# Altium project SAVELIEV_OLEKSANDR_KV_22_COURSEWORK.PrjPcb
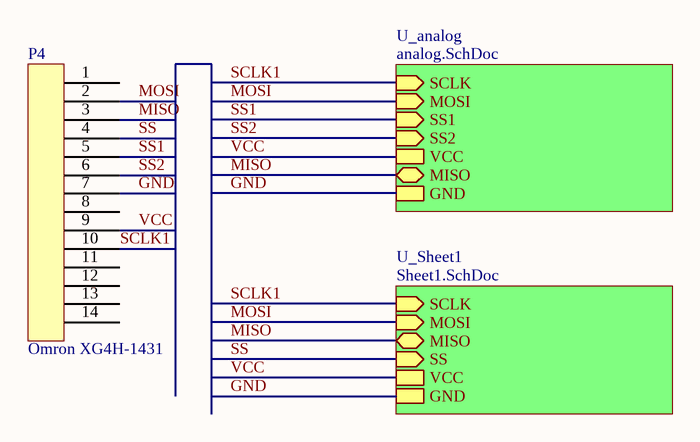
[diagram p0: KR1.SchDoc]
4 sheets, 168 parts. Net scope: hierarchical (ports join the sheet entries above them; power ports are global).
Sheets:
  KR1.SchDoc
    U_analog = analog.SchDoc
    U_Sheet1 = Sheet1.SchDoc
      U_Sheet2 = Sheet2.SchDoc
      U_Sheet2 = Sheet2.SchDoc
      U_Sheet2 = Sheet2.SchDoc
      U_Sheet2 = Sheet2.SchDoc

## Sheet KR1.SchDoc
size A4; SheetNumber: 1; SheetTotal: 4

### Parts
P4  Omron XG4H-1431  [PCB-ufmg19m1jja1hi8pwkok-1]

### Sub-sheets
U_analog = analog.SchDoc: SCLK (in), MOSI (in), SS1 (in), SS2 (in), VCC, MISO (bidir), GND
U_Sheet1 = Sheet1.SchDoc: SCLK (in), MOSI (in), MISO (bidir), SS (in), VCC, GND

### Nets
GND: P4.7 ; sheet U_analog/GND, sheet U_Sheet1/GND
MISO: P4.3 ; sheet U_analog/MISO, sheet U_Sheet1/MISO
MOSI: P4.2 ; sheet U_analog/MOSI, sheet U_Sheet1/MOSI
SCLK1: P4.10 ; sheet U_analog/SCLK, sheet U_Sheet1/SCLK
SS: P4.4 ; sheet U_Sheet1/SS
SS1: P4.5 ; sheet U_analog/SS1
SS2: P4.6 ; sheet U_analog/SS2
VCC: P4.9 ; sheet U_analog/VCC, sheet U_Sheet1/VCC

Not connected (* = marked no-connect by the designer): P4 1 8 11 12 13 14

### Library data of the parts
P4 = CMP-754fbc3c8639aa88-2: Conn Socket Strip SKT 14 POS 2.54mm Solder ST Thru-Hole; Manufacturer Part Number: XG4H-1431; Mounting Style: Through Hole; OctopartID: 754fbc3c8639aa88; RoHS: Compliant; Octopart URL: https://octopart.com/xg4h-1431-omron-7984656; Packaging: Bulk; Color: Black

## Sheet analog.SchDoc
size A3; SheetNumber: 4; SheetTotal: 4
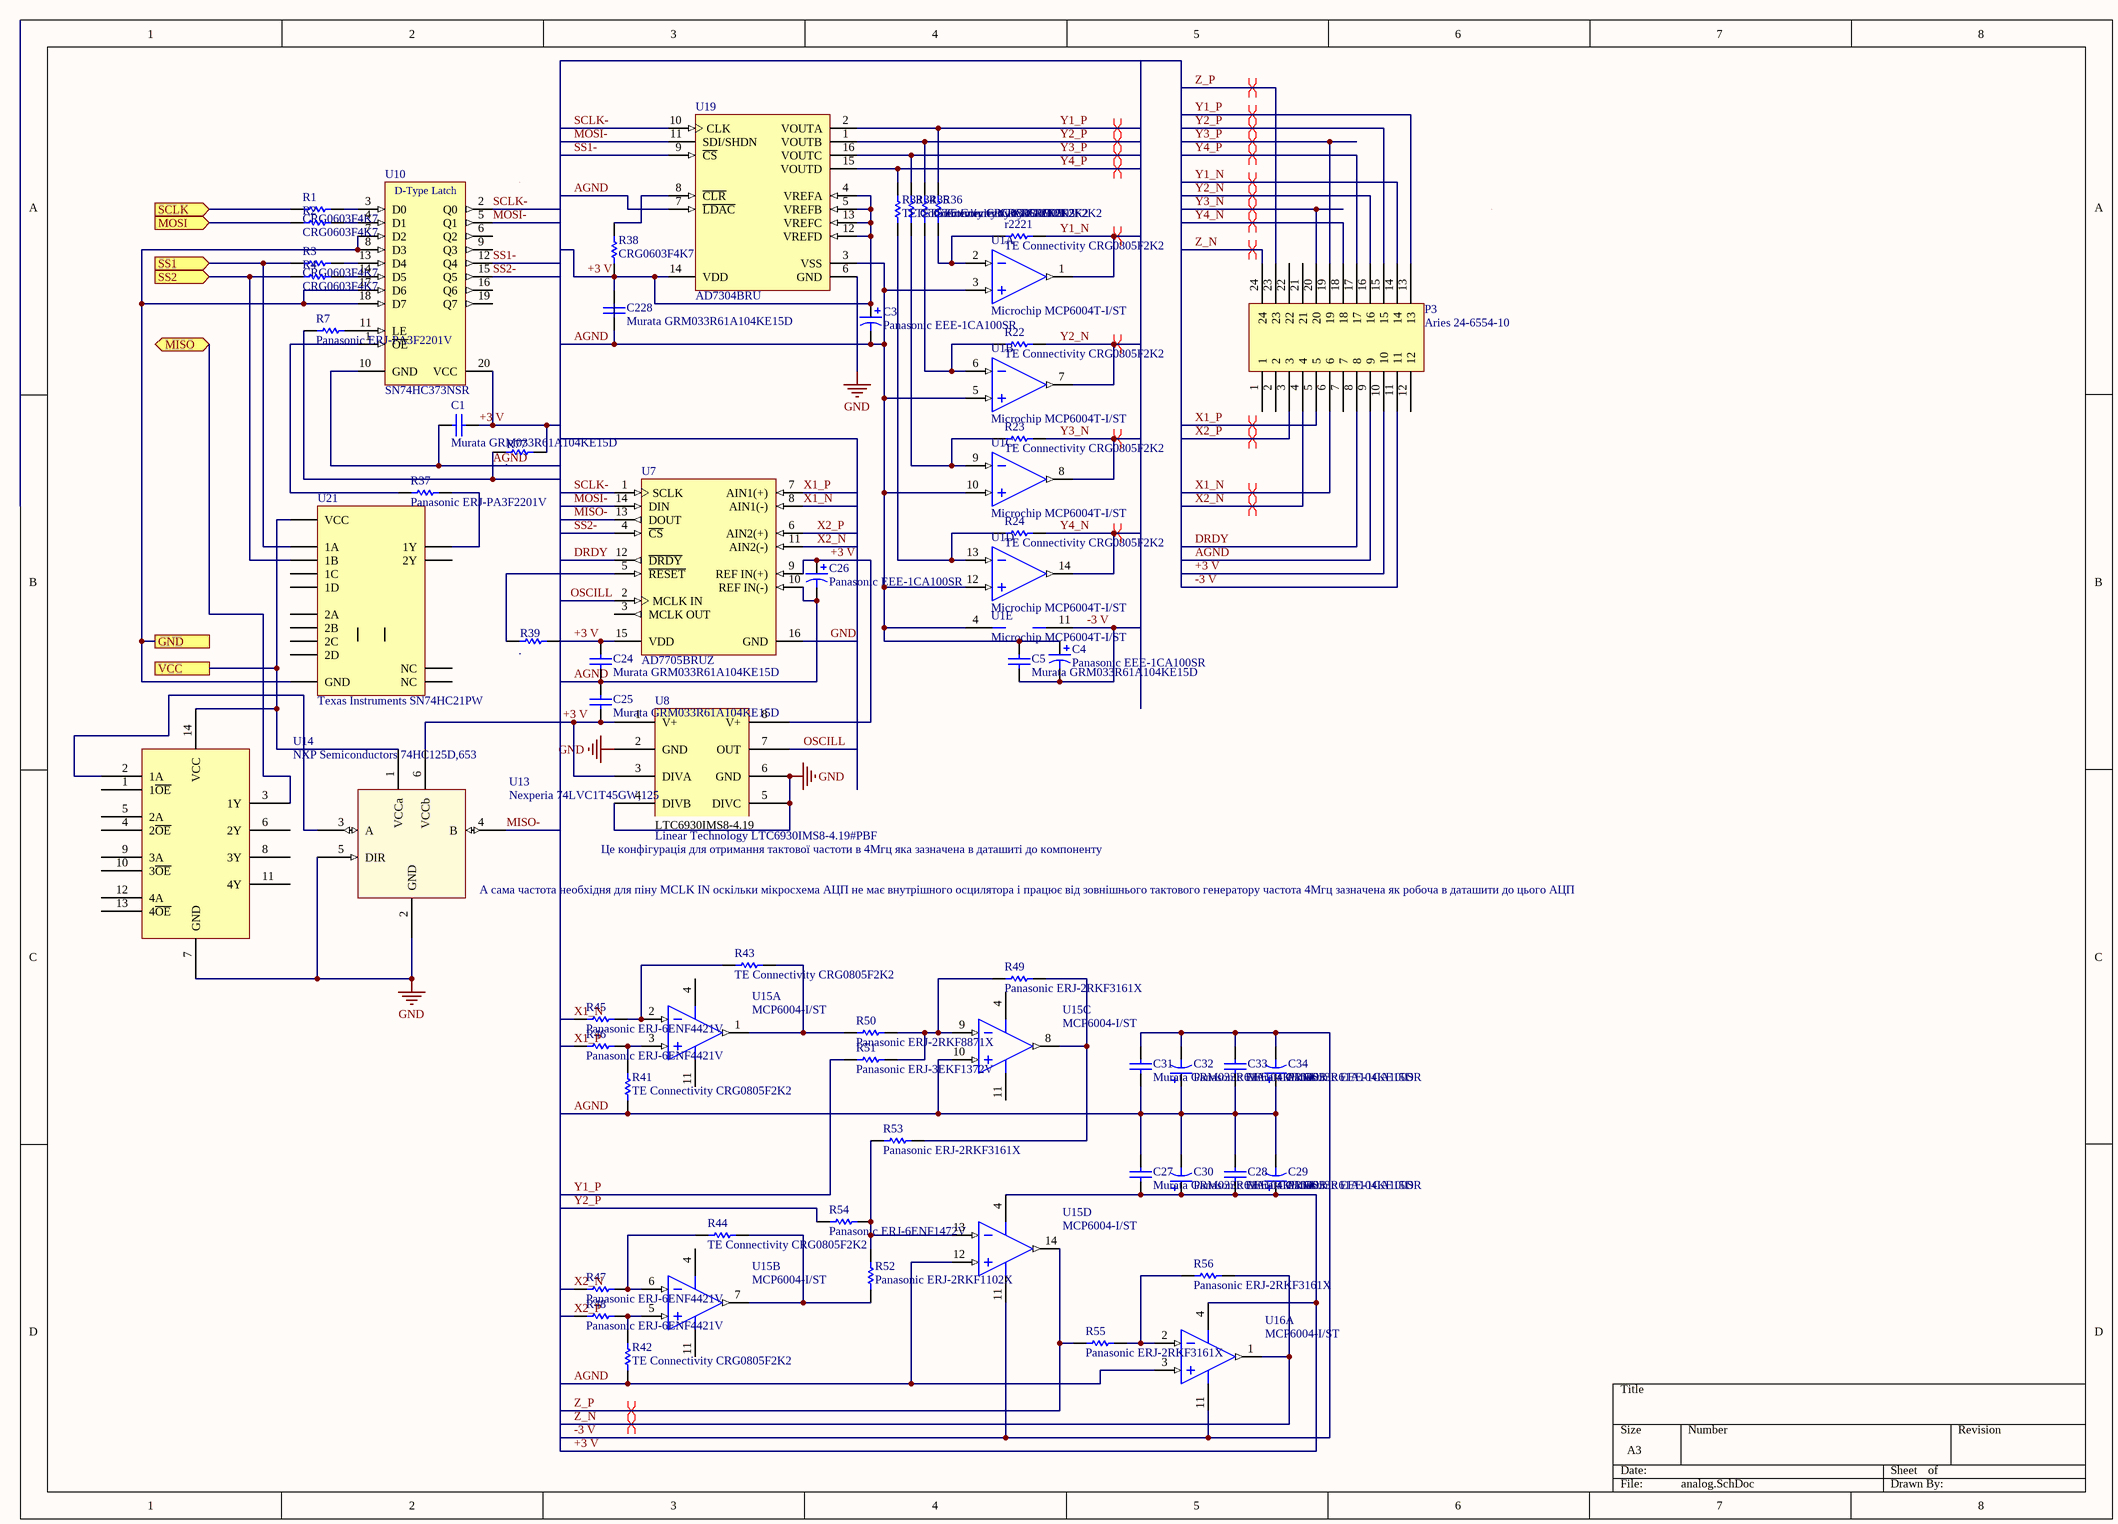
[diagram p1: analog.SchDoc]

### Parts
C1  Murata GRM033R61A104KE15D  [201-cap]
C3  Panasonic EEE-1CA100SR  [PCB-5c7lwdch6d5n3jfyiyq6-1]
C4  Panasonic EEE-1CA100SR  [PCB-5c7lwdch6d5n3jfyiyq6-1]
C5  Murata GRM033R61A104KE15D  [201-cap]
C24  Murata GRM033R61A104KE15D  [201-cap]
C25  Murata GRM033R61A104KE15D  [201-cap]
C26  Panasonic EEE-1CA100SR  [PCB-5c7lwdch6d5n3jfyiyq6-1]
C27  Murata GRM033R61A104KE15D  [201-cap]
C28  Murata GRM033R61A104KE15D  [201-cap]
C29  Panasonic EEE-1CA100SR  [PCB-5c7lwdch6d5n3jfyiyq6-1]
C30  Panasonic EEE-1CA100SR  [PCB-5c7lwdch6d5n3jfyiyq6-1]
C31  Murata GRM033R61A104KE15D  [201-cap]
C32  Panasonic EEE-1CA100SR  [PCB-5c7lwdch6d5n3jfyiyq6-1]
C33  Murata GRM033R61A104KE15D  [201-cap]
C34  Panasonic EEE-1CA100SR  [PCB-5c7lwdch6d5n3jfyiyq6-1]
C228  Murata GRM033R61A104KE15D  [201-cap]
P3  Aries 24-6554-10  [PCB-ekyruasckp3dwikngkzw-1]
R1  CRG0603F4K7  [RESC1609X50X30ML10T20]
R2  CRG0603F4K7  [RESC1609X50X30ML10T20]
R3  CRG0603F4K7  [RESC1609X50X30ML10T20]
R4  CRG0603F4K7  [RESC1609X50X30ML10T20]
R7  Panasonic ERJ-PA3F2201V  [RESC1608X55X30LL15T15]
R22  TE Connectivity CRG0805F2K2  [RESC3216X70X50LL05T20]
R23  TE Connectivity CRG0805F2K2  [RESC3216X70X50LL05T20]
R24  TE Connectivity CRG0805F2K2  [RESC3216X70X50LL05T20]
R33  TE Connectivity CRG0805F2K2  [RESC3216X70X50LL05T20]
R34  TE Connectivity CRG0805F2K2  [RESC3216X70X50LL05T20]
R35  TE Connectivity CRG0805F2K2  [RESC3216X70X50LL05T20]
R36  TE Connectivity CRG0805F2K2  [RESC3216X70X50LL05T20]
R37  Panasonic ERJ-PA3F2201V  [RESC1608X55X30LL15T15]
R38  CRG0603F4K7  [RESC1609X50X30ML10T20]
R39  .  [RESC1608X55X30LL15T15]
R41  TE Connectivity CRG0805F2K2  [RESC3216X70X50LL05T20]
R42  TE Connectivity CRG0805F2K2  [RESC3216X70X50LL05T20]
R43  TE Connectivity CRG0805F2K2  [RESC3216X70X50LL05T20]
R44  TE Connectivity CRG0805F2K2  [RESC3216X70X50LL05T20]
R45  Panasonic ERJ-6ENF4421V  [RESC2013X70X40ML20T20]
R46  Panasonic ERJ-6ENF4421V  [RESC2013X70X40ML20T20]
R47  Panasonic ERJ-6ENF4421V  [RESC2013X70X40ML20T20]
R48  Panasonic ERJ-6ENF4421V  [RESC2013X70X40ML20T20]
R49  Panasonic ERJ-2RKF3161X  [RESC1005X40X25ML05T05]
R50  Panasonic ERJ-2RKF8871X  [RESC1005X40X25ML05T05]
R51  Panasonic ERJ-3EKF1372V  [RESC1608X55X30LL15T15]
R52  Panasonic ERJ-2RKF1102X  [RESC1005X40X25ML05T05]
R53  Panasonic ERJ-2RKF3161X  [RESC1005X40X25ML05T05]
R54  Panasonic ERJ-6ENF1472V  [RESC2013X70X40LL20T20]
R55  Panasonic ERJ-2RKF3161X  [RESC1005X40X25ML05T05]
R56  Panasonic ERJ-2RKF3161X  [RESC1005X40X25ML05T05]
R77  .  [RESC1608X55X30LL15T15]
r2221  TE Connectivity CRG0805F2K2  [RESC3216X70X50LL05T20]
U1  Microchip MCP6004T-I/ST  [PCB-qd5l9gv8ivpyuc7qt6ns-1]  (parts A,B,C,D,E of 5)
U7  AD7705BRUZ  [RU-16_N]
U8  Linear Technology LTC6930IMS8-4.19#PBF  [PCB-f6jmd1xdx0tvjqeq7wyy-1]
U10  SN74HC373NSR  [PCB-mrivl7f71t22rnyfb9oh-1]
U13  Nexperia 74LVC1T45GW,125  [PCB-2kx227qvn7pif93bx96a-1]
U14  NXP Semiconductors 74HC125D,653  [SO14]
U15  MCP6004-I/ST  [TSSOP-ST14_L]  (parts A,B,C,D of 4)
U16  MCP6004-I/ST  [TSSOP-ST14_L]  (part A of 4)
U19  AD7304BRU  [RU-16_M]
U21  Texas Instruments SN74HC21PW  [PCB-zlibg0os7u66y1b7c6dv-1]

### Ports
GND, MISO (bidir), MOSI (in), SCLK (in), SS1 (in), SS2 (in), VCC

### Nets
GND: U7.16(GND) U8.2(GND) U8.4(DIVB) U8.5(DIVC) U8.6(GND) U10.7(D2) U10.8(D3) U10.17(D6) U10.18(D7) U13.2(GND) U13.5(DIR) U14.7(GND) U19.6(GND) U21.7(GND) ; port GND
+3 V: C1.2 C3.1 C24.1 C25.2 C26.1 C27.2 C28.2 C29.1 C30.1 C228.1 P3.10 R38.1 R39.2 R77.2 U7.9(REF_IN(+)) U7.15(VDD) U8.1(V+) U8.3(DIVA) U8.8(V+) U10.20(VCC) U13.6(VCCb) U15.4(VDD) U16.4(VDD) U19.4(VREFA) U19.5(VREFB) U19.12(VREFD) U19.13(VREFC) U19.14(VDD)
-3 V: C4.2 C5.2 C31.1 C32.2 C33.1 C34.2 P3.11 U1.11(VSS) U15.11(VSS) U16.11(VSS)
AGND: C1.1 C3.2 C4.1 C5.1 C24.2 C25.1 C26.2 C27.1 C28.1 C29.2 C30.2 C31.2 C32.1 C33.2 C34.1 C228.2 P3.9 R7.1 R41.1 R42.1 R77.1 U1.3(INA+) U1.4(VDD) U1.5(INB+) U1.10(INC+) U1.12(IND+) U7.10(REF_IN(-)) U10.10(GND) U15.10(VINC+) U15.12(VIND+) U16.3(VINA+) U19.3(VSS) U19.7(~{LDAC})
DRDY: P3.8 U7.12(~{DRDY})
MISO: U14.3(1Y) ; port MISO
MISO-: U7.13(DOUT) U13.4(B)
MOSI: R2.1 ; port MOSI
MOSI-: U7.14(DIN) U10.5(Q1) U19.11(SDI/SHDN)
OSCILL: U7.2(MCLK_IN) U8.7(OUT)
SCLK1: R1.1 ; port SCLK
SCLK-: U7.1(SCLK) U10.2(Q0) U19.10(CLK)
SS1: R3.1 U21.1(1A) ; port SS1
SS1-: U10.12(Q4) U19.9(~{CS})
SS2: R4.1 U21.2(1B) ; port SS2
SS2-: U7.4(~{CS}) U10.15(Q5)
VCC: U13.1(VCCa) U14.14(VCC) U21.14(VCC) ; port VCC
X1_N: P3.6 R45.1 U7.8(AIN1(-))
X1_P: P3.5 R46.1 U7.7(AIN1(+))
X2_N: P3.4 R47.1 U7.11(AIN2(-))
X2_P: P3.3 R48.1 U7.6(AIN2(+))
Y1_N: P3.14 r2221.2 U1.1(OUTA)
Y1_P: P3.13 R36.2 R51.1 U19.2(VOUTA)
Y2_N: P3.16 R22.2 U1.7(OUTB)
Y2_P: P3.15 R35.2 R54.1 U19.1(VOUTB)
Y3_N: P3.20 R23.2 U1.8(OUTC)
Y3_P: P3.19 R34.2 U19.16(VOUTC)
Y4_N: P3.18 R24.2 U1.14(OUTD)
Y4_P: P3.17 R33.2 U19.15(VOUTD)
Z_N: P3.24 R56.2 U16.1(VOUTA)
Z_P: P3.23 R55.1 U15.14(VOUTD)
NetR1_2: R1.2 U10.3(D0)
NetR2_2: R2.2 U10.4(D1)
NetR3_2: R3.2 U10.13(D4)
NetR4_2: R4.2 U10.14(D5)
NetR7_2: R7.2 U10.11(LE)
NetR22_1: R22.1 R35.1 U1.6(INB-)
NetR23_1: R23.1 R34.1 U1.9(INC-)
NetR24_1: R24.1 R33.1 U1.13(IND-)
NetR36_1: R36.1 r2221.1 U1.2(INA-)
NetR37_1: R37.1 U10.1(~{OE})
NetR37_2: R37.2 U21.6(1Y)
NetR38_2: R38.2 U19.8(~{CLR})
NetR39_1: R39.1 U7.5(~{RESET})
NetR41_2: R41.2 R46.2 U15.3(VINA+)
NetR42_2: R42.2 R48.2 U15.5(VINB+)
NetR43_1: R43.1 R50.1 U15.1(VOUTA)
NetR43_2: R43.2 R45.2 U15.2(VINA-)
NetR44_1: R44.1 R52.1 U15.7(VOUTB)
NetR44_2: R44.2 R47.2 U15.6(VINB-)
NetR49_1: R49.1 R50.2 R51.2 U15.9(VINC-)
NetR49_2: R49.2 R53.2 U15.8(VOUTC)
NetR52_2: R52.2 R53.1 R54.2 U15.13(VIND-)
NetR55_2: R55.2 R56.1 U16.2(VINA-)
NetU13_3: U13.3(A) U14.2(1A)

Not connected (* = marked no-connect by the designer): P3 1 2 7 12 21 22; U7 3(MCLK_OUT); U10 6(Q2) 9(Q3) 16(Q6) 19(Q7); U14 1(1~{OE}) 4(2~{OE}) 5(2A) 6(2Y) 8(3Y) 9(3A) 10(3~{OE}) 11(4Y) 12(4A) 13(4~{OE}); U21 3(NC) 4(1C) 5(1D) 8(2Y) 9(2A) 10(2B) 11(NC) 12(2C) 13(2D)

### Layout directives
differential pair: X1_N, X1_P, X2_N, X2_P, Y1_N, Y1_P, Y2_N, Y2_P, Y3_N, Y3_P, Y4_N, Y4_P, Z_N, Z_P

### Notes on the sheet
- (near U8) Це конфігурація для отримання тактової частоти в 4Мгц яка зазначена в даташиті до компоненту
- (near U13) А сама частота необхідня для піну MCLK IN оскільки мікросхема АЦП не має внутрішного осцилятора і працює від зовнішнього тактового генератору частота 4Мгц зазначена як робоча в даташити до цього АЦП
- (in symbol CMP-209beb569da8ff5c-2) D-Type Latch
- (in symbol CMP-b5277c902da26ae0-2) LTC6930IMS8-4.19

### Library data of the parts
C1 C5 C24 C25 C27 C28 C31 C33 C228 = CMP-118834-6: Cap Ceramic 0.1uF 10V X5R 10% SMD 0201 85C Paper T/R; Lead-Free Status: Lead Free; Case/Package (SI): 0603; Capacitance: 100 nF; REACH SVHC Compliance: No SVHC; Capacitance Tolerance: ±10%; Voltage Rating (DC): 10 V; Lifecycle Status: Active; Octopart Url: https://octopart.com/grm033r61a104ke15d-murata-9105476; Footprint: PCB-ocfpa7uzfom1ouwa1npm-1; Size-Length: 0.0006 m; Size-Thickness: 0.0003 m; Manufacturer Part Number: GRM033R61A104KE15D; Dielectric Characteristic: X5R; OctopartID: 128bdb0bc7a9cd4c; RoHS: Compliant; Size-Width: 0.0003 m
C3 C4 C26 C29 C30 C32 C34 = CMP-1d6cd72bfd77c2ab-7: Capacitor Alum Elec, 10uf, 16v, 20%, Scapacitor Alum Elec, 10uf, 16v, 20%, Smd, Full Reel; Footprint: PCB-yczte4gnpn9q1jdovplr-1
P3 = CMP-1a82d3838c70c545-1: Connector Test Socket Receptacle 24 Position 2.54mm Solder Straight Thru-Hole; Number of Positions: 24; Lead-Free Status: Lead Free; Insulation Resistance: 1.00 GΩ; Number of Mating Cycles: 25000; Mounting Angle: 180 °; Contact Material: Beryllium Copper; Flammability Rating: UL 94 V-0; Size-Width: 22.9 mm; Number of Contacts: 24; Number of Pins: 24; Packaging: Tube; Octopart URL: https://octopart.com/24-6554-10-aries-766868; Contact Plating: Tin, Tin over Nickel; RoHS: Compliant; Size-Height: 11.9 mm; Size-Length: 44.2 mm; Manufacturer Part Number: 24-6554-10; Mounting Style: PC Board, Through Hole, Vertical; OctopartID: 1a82d3838c70c545; Operating Temperature: 105 °C (max); REACH SVHC Compliance: No SVHC
R1-R4 R38 = CMP-0018c9d2ab3ddfdf-10: Res Thick Film 0603 4.7K Ohm 1% 0.1W(1/10W) ±100ppm/C Pad SMD T/R; ELV Compliant: Compliant; Power Rating: 100 mW; Resistance: 4.70 kΩ; Octopart Url: https://octopart.com/crg0603f4k7-te+connectivity-12619331; RoHS: Compliant; Mounting Style: Surface Mount; OctopartID: 0018c9d2ab3ddfdf; Manufacturer Part Number: CRG0603F4K7; Lifecycle Status: Active; Packaging: Tape & Reel (TR)
R7 R37 = CMP-b7b87dbc5d06687f-2: Res Thick Film 0603 2.2K Ohm 1% 0.25W(1/4W) ±100ppm/C Pad SMD Automotive T/R; Temperature Coefficient: -100 ppm/°C to 100 ppm/°C; Resistance: 2.20 kΩ; Case/Package (SI): 1608; Power Rating: 250 mW; Voltage Rating (DC): 150 V; RoHS: Compliant; Packaging: Cut Tape (CT); Lifecycle Status: Not Listed by Manufacturer; Manufacturer Part Number: ERJ-PA3F2201V; Resistance Tolerance: ±1%; Footprint: PCB-0002-00066-3; OctopartID: b7b87dbc5d06687f; Octopart URL: https://octopart.com/erj-pa3f2201v-panasonic-51302360; REACH SVHC Compliance: No SVHC; Case/Package: 1608, 0603
R22-R24 R33-R36 R41-R44 r2221 = CMP-5b0a92f52cd384cd-1: Res Thick Film 0805 2.2K Ohm 1% 0.125W(1/8W) ±100ppm/C Pad SMD T/R; Resistance: 2.20 kΩ; ELV Compliant: Compliant; Power Rating: 125 mW; Case/Package (SI): 2012; OctopartID: 5b0a92f52cd384cd; Case/Package: 0805; Mounting Style: Surface Mount; Manufacturer Part Number: CRG0805F2K2; Octopart Url: https://octopart.com/crg0805f2k2-te+connectivity-16077503; RoHS: Compliant; Lifecycle Status: Active; Packaging: Tape & Reel (TR)
R39 R77 = CMP-b7b87dbc5d06687f-2: Res Thick Film 0603 2.2K Ohm 1% 0.25W(1/4W) ±100ppm/C Pad SMD Automotive T/R; Manufacturer Part Number: ERJ-PA3F2201V; Temperature Coefficient: -100 ppm/°C to 100 ppm/°C; Resistance: 2.20 kΩ; Case/Package (SI): 1608; Power Rating: 250 mW; Voltage Rating (DC): 150 V; RoHS: Compliant; Packaging: Cut Tape (CT); Lifecycle Status: Not Listed by Manufacturer; Resistance Tolerance: ±1%; Footprint: PCB-0002-00066-3; OctopartID: b7b87dbc5d06687f; Octopart URL: https://octopart.com/erj-pa3f2201v-panasonic-51302360; REACH SVHC Compliance: No SVHC; Case/Package: 1608, 0603
R45-R48 = CMP-3915389-2: RESISTOR, THICK FILM, 4.42KOHM, 125mW, ± 1%; Case/Package (SI): 2012; Lead-Free Status: Lead Free; Power Rating: 0.125 W; Resistance: 4420.0 Ω; Voltage Rating (DC): 150.0 V; Manufacturer Part Number: ERJ-6ENF4421V; Case/Package: 0805; Lifecycle Status: Not Listed by Manufacturer; Mounting Style: Surface Mount; Octopart Url: https://octopart.com/erj-6enf4421v-panasonic-55405047; OctopartID: a5ed6faae97c7a2a; REACH SVHC Compliance: No SVHC; Resistance Tolerance: ±1%; RoHS: Compliant; Size-Height: 0.0006 m; Size-Length: 0.002 m; Size-Width: 0.00125 m
R49 R53 R55 R56 = CMP-3651018-2: Thick Film Resistors - SMD 0402 3.16Kohms 1% Tol; Lead-Free Status: Lead Free; Power Rating: 0.1 W; Resistance: 3160.0 Ω; Voltage Rating (DC): 50.0 V; Case/Package: 0402; Lifecycle Status: Not Listed by Manufacturer; Mounting Style: Surface Mount; Octopart Url: https://octopart.com/erj-2rkf3161x-panasonic-55421100; OctopartID: ad456702208f7282; REACH SVHC Compliance: No SVHC; Resistance Tolerance: ±1%; RoHS: Compliant; Size-Height: 0.00035 m; Size-Length: 0.001 m; Size-Width: 0.0005 m; Manufacturer Part Number: ERJ-2RKF3161X
R50 = CMP-3673565-2: Thick Film Resistors - SMD 0402 8.87Kohms 1% Tol; Lead-Free Status: Contains Lead; Power Rating: 0.1 W; Resistance: 8870.0 Ω; Voltage Rating (DC): 50.0 V; Manufacturer Part Number: ERJ-2RKF8871X; Case/Package: 0402; Lifecycle Status: Not Listed by Manufacturer; Mounting Style: Surface Mount; Octopart Url: https://octopart.com/erj-2rkf8871x-panasonic-55421316; OctopartID: d2f818bf5e1a0d3f; REACH SVHC Compliance: No SVHC; Resistance Tolerance: ±1%; RoHS: Compliant; Size-Height: 0.00035 m; Size-Length: 0.001 m; Size-Width: 0.0005 m
R51 = CMP-3656443-2: Thick Film Resistors - SMD 0603 13.7Kohms 1% Tol; Lead-Free Status: Contains Lead; Power Rating: 0.1 W; Resistance: 13700.0 Ω; Voltage Rating (DC): 75.0 V; Manufacturer Part Number: ERJ-3EKF1372V; Case/Package: 0603; Lifecycle Status: Not Listed by Manufacturer; Mounting Style: Surface Mount; Octopart Url: https://octopart.com/erj-3ekf1372v-panasonic-55411167; OctopartID: ddb117f679080276; Packaging: Cut Tape (CT); REACH SVHC Compliance: No SVHC; Resistance Tolerance: ±1%; RoHS: Compliant; Size-Height: 0.00045 m; Size-Length: 0.0016 m; Size-Width: 0.0008 m
R52 = CMP-1847061-3: Res Thick Film 0402 11K Ohm 1% 1/10W ±100ppm/C Molded SMD Punched Carrier T/R; Voltage Rating (DC): 50.0 V; Lead-Free Status: Lead Free; Resistance: 11000.0 Ω; Power Rating: 0.1 W; Size-Length: 0.001 m; RoHS: Compliant; Resistance Tolerance: ±1%; Octopart Url: https://octopart.com/erj-2rkf1102x-panasonic-55389235; Manufacturer Part Number: ERJ-2RKF1102X; OctopartID: bb9871dfb2cd645f; REACH SVHC Compliance: No SVHC; Size-Width: 0.0005 m; Lifecycle Status: Not Listed by Manufacturer; Size-Height: 0.00035 m; Case/Package: 0402; Footprint: PCB-406olm0ev1nhc4a39vl6-1; Packaging: Cut Tape (CT); Mounting Style: Surface Mount
R54 = CMP-3677441-2: Thick Film Resistors - SMD 0805 14.7Kohms 1% Tol; Case/Package (SI): 2012; Lead-Free Status: Lead Free; Power Rating: 0.125 W; Resistance: 14700.0 Ω; Voltage Rating (DC): 150.0 V; Case/Package: 0805; Lifecycle Status: Not Listed by Manufacturer; Mounting Style: Surface Mount; Octopart Url: https://octopart.com/erj-6enf1472v-panasonic-55422409; OctopartID: 6956a311e1f9b691; REACH SVHC Compliance: No SVHC; Resistance Tolerance: ±1%; RoHS: Compliant; Size-Height: 0.0006 m; Size-Length: 0.002 m; Size-Width: 0.00125 m; Manufacturer Part Number: ERJ-6ENF1472V
U1 = CMP-1324864-8: MCP6004 Series 6 V 1 MHz SMT Low-Power Operational Amplifier - TSSOP-14
U7 = CMP-16014805-4: Dual 16-Bit Sigma-Delta Analog-to-Digital Converter with Serial, SPI Interface, 1 mW, 3 V / 5 V, 500SPS, -40 to +85 degC, RU-16, Pb-Free, Tube; Mil-Spec: No; Number of Bits: 16; Input Impedance: 9000000000.0 Ω; Sample Rate: 500.0 Hz; Lead-Free Status: Contains Lead; Resolution (Bits): 16.0; Supply Current: 0.0013 A; Power Dissipation: 0.0065 W; Input Capacitance: 1e-11 F; Number of Pins: 16; Manufacturer Part Number: AD7705BRUZ; RoHS: Compliant; Packaging: Bulk; Case/Package: TSSOP; OctopartID: 1cf3d5ff1dbec334; Mounting Style: Surface Mount; REACH SVHC Compliance: No SVHC; Octopart Url: https://octopart.com/ad7705bruz-analog+devices-402475; Lifecycle Status: Active
U8 = CMP-b5277c902da26ae0-2: SC-Timing, 32.76kHz-8.192MHz Precision u; SC-Timing, 32.76kHz-8.192MHz Precision uPower Oscillators; Manufacturer Part Number: LTC6930IMS8-5.00#PBF; Frequency: 5.00 MHz; Supply Voltage (DC): 1.70 V (min); Case/Package: MSOP; RoHS: Compliant; Octopart URL: http://octopart.com/ltc6930ims8-5.00%23pbf-linear+technology-12434915; Number of Pins: 8; OctopartID: b5277c902da26ae0
U10 = CMP-209beb569da8ff5c-2: Octal Transparent D-Type Latches With 3-State Outputs 20-SO -40 to 85; Output Current: 7.80 mA; Supply Voltage (DC): 2.00 V to 6.00 V; Output Current Drive: -1.00 mA; Number of Circuits: 8; Voltage Nodes: 6.00 V, 5.00 V, 2.00 V; Lead-Free Status: Lead Free; Polarity: Non-Inverting; Propagation Delay Max (tpd): 32.0 ns; RoHS: Compliant; Octopart URL: http://octopart.com/sn74hc373nsr-texas+instruments-46635093; Number of Pins: 20; REACH SVHC Compliance: No SVHC; Packaging: Tape & Reel (TR); Manufacturer Part Number: SN74HC373NSR; OctopartID: 209beb569da8ff5c; Case/Package: SOP; Number of Outputs: 8; Number of Bits: 8; Mounting Style: Surface Mount; Lifecycle Status: Active
U13 = CMP-9dea5051caa8422d-3: 74LVC1T45; 74LVCH1T45 - Dual supply translating transceiver; 3-state; Supply Voltage (DC): 5.50 V (max), 1.20 V (min); Lead-Free Status: Lead Free; Lifecycle Status: Active; Manufacturer Part Number: 74LVC1T45GW,125; RoHS: Compliant; OctopartID: 9dea5051caa8422d; Number of Pins: 6; Octopart URL: https://octopart.com/74lvc1t45gw%2C125-nexperia-78737956; REACH SVHC Compliance: No SVHC; Operating Temperature: -40.0 °C (min); Case/Package: SOT-363; Mounting Style: Surface Mount; Packaging: Tape & Reel (TR)
U14 = CMP-e63b2fae16a839fc-1: 74HC Series 6 V Surface Mount 3-State Quad Buffer/Line Driver - SOIC-14; Lead-Free Status: Lead Free; Number of Gates: 4; Supply Voltage (DC): 2.00 V (min); REACH SVHC Compliance: No SVHC; Lifecycle Status: Active; Packaging: Tape & Reel (TR); Manufacturer Part Number: 74HC125D,653; OctopartID: e63b2fae16a839fc; Octopart URL: http://octopart.com/74hc125d%2C653-nxp+semiconductors-10474997; Number of Pins: 14; RoHS: Compliant
U15 U16 = CMP-1319670-3: 1 MHz, Low-Power Operational Amplifier, 14-Pin TSSOP, Industrial Temperature; Bandwidth: 1000000.0 Hz; Input Offset Drift: 2e-06 V/K; Lead-Free Status: Lead Free; Number of Circuits: 4; Slew Rate: 0.6 V/μs; Gain Bandwidth Product: 1000000.0 Hz; Lifecycle Status: Active; Mounting Style: Surface Mount; Number of Pins: 14; Octopart Url: https://octopart.com/mcp6004-i%2Fst-microchip-419111; OctopartID: 6e09a7052e48b1ce; REACH SVHC Compliance: No SVHC; RoHS: Compliant; Manufacturer Part Number: MCP6004-I/ST
U19 = CMP-4908888-3: Quad 8-Bit Rail-to-Rail Output Digital-to-Analog Converter, 3 V / 5 V, -40 to +85 degC, RU-16, Tube; Lead-Free Status: Contains Lead; Mil-Spec: No; Number of Bits: 8; Power Dissipation: 0.06 W; Resolution (Bits): 8.0; Manufacturer Part Number: AD7304BRU; Case/Package: TSSOP; Lifecycle Status: Active; Mounting Style: Surface Mount; Number of Pins: 16; Octopart Url: https://octopart.com/ad7304bru-analog+devices-435563; OctopartID: 939e5a9213934c59; Packaging: Bulk; RoHS: Non-Compliant
U21 = CMP-6615af12324ab9d2-2: AND Gate 2-Element 4-IN CMOS 14-Pin TSSOP Tube; Number of Bits: 2; Output Current Drive: -1.00 mA; Supply Voltage (DC): 2.00 V to 6.00 V; Lead-Free Status: Lead Free; Propagation Delay Max (tpd): 140 ns, 24.0 ns; Output Current: 5.20 mA; Voltage Nodes: 2.00 V, 5.00 V, 6.00 V, 4.50 V; Octopart URL: https://octopart.com/sn74hc21pw-texas+instruments-880953; Manufacturer Part Number: SN74HC21PW; OctopartID: 6615af12324ab9d2; REACH SVHC Compliance: No SVHC; Number of Pins: 14; RoHS: Compliant; Case/Package: TSSOP; Packaging: Tube, Rail; Lifecycle Status: Active; Mounting Style: Surface Mount; Number of Gates: 2; Operating Temperature: -40.0 °C to 85.0 °C

## Sheet Sheet1.SchDoc
size A2; SheetNumber: 2; SheetTotal: 4
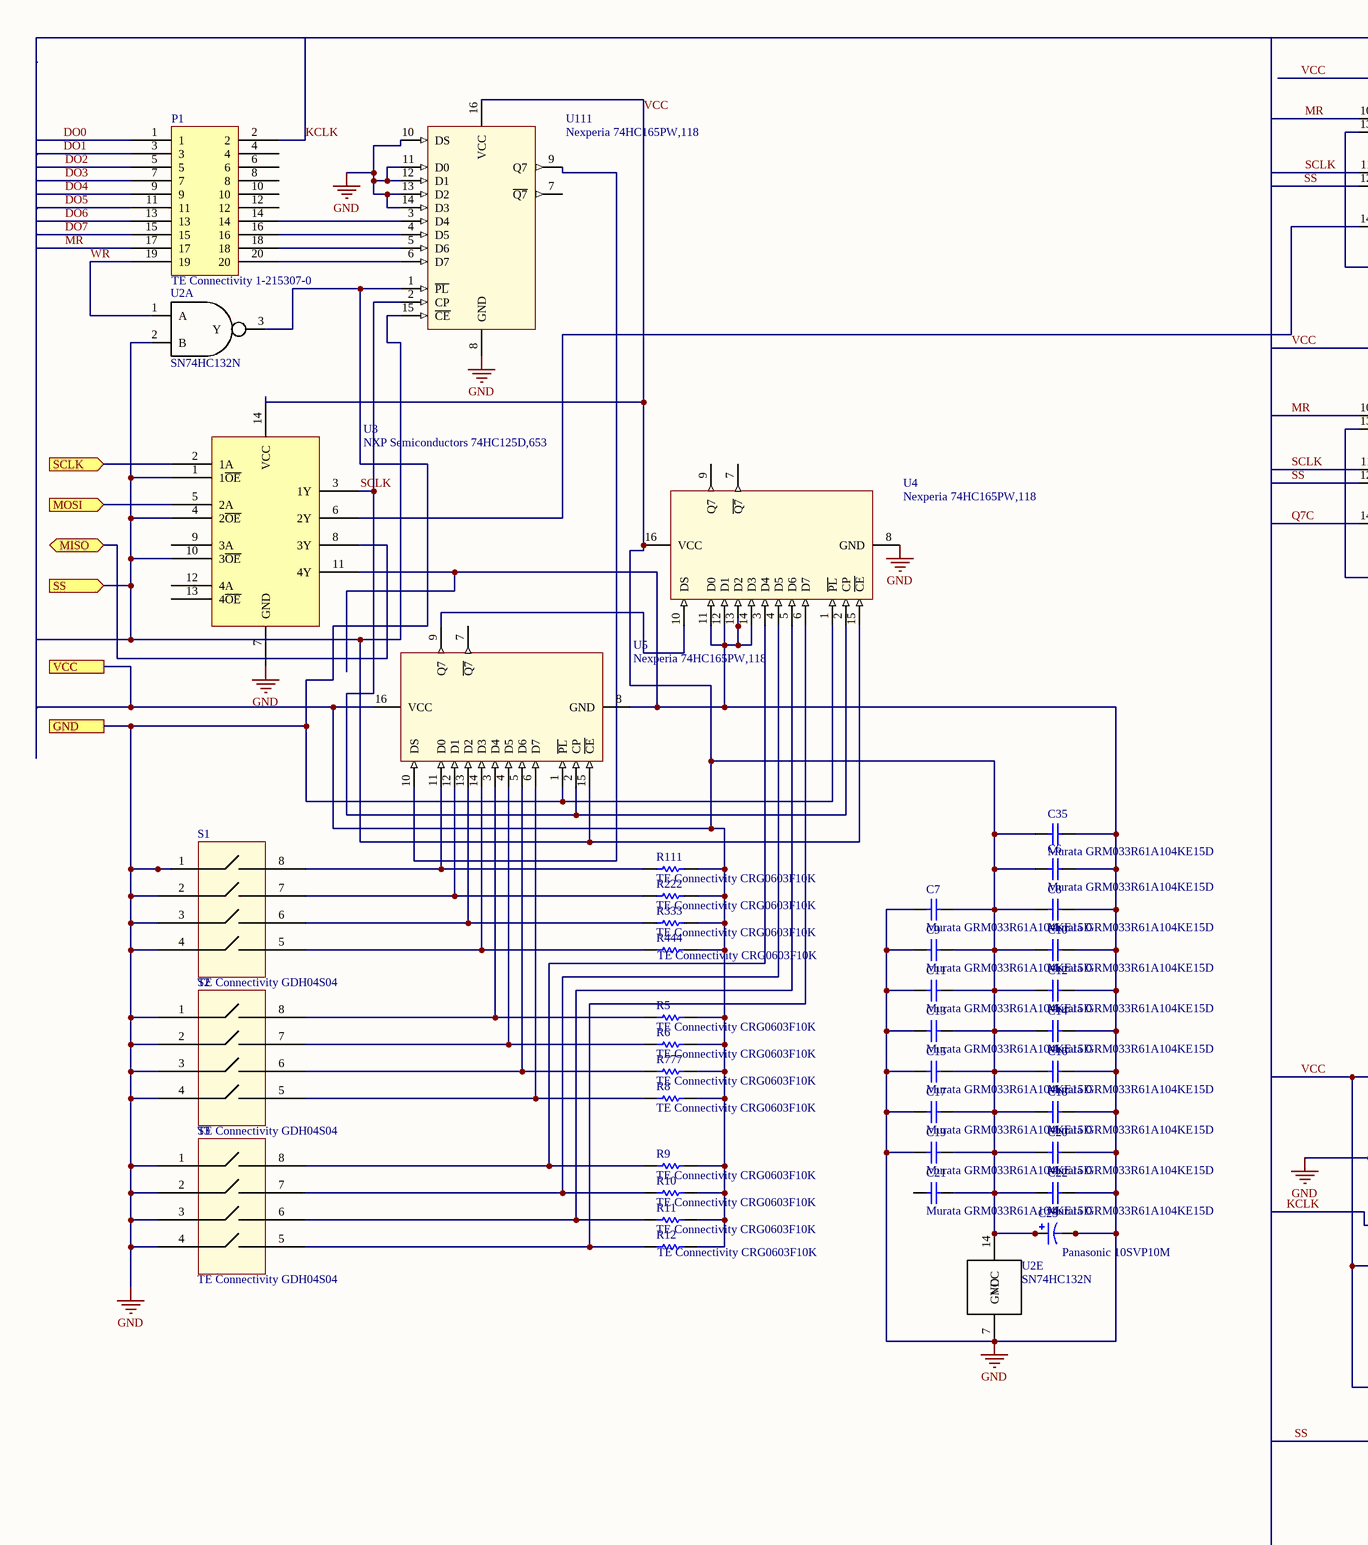
[diagram p2: Sheet1.SchDoc, left]
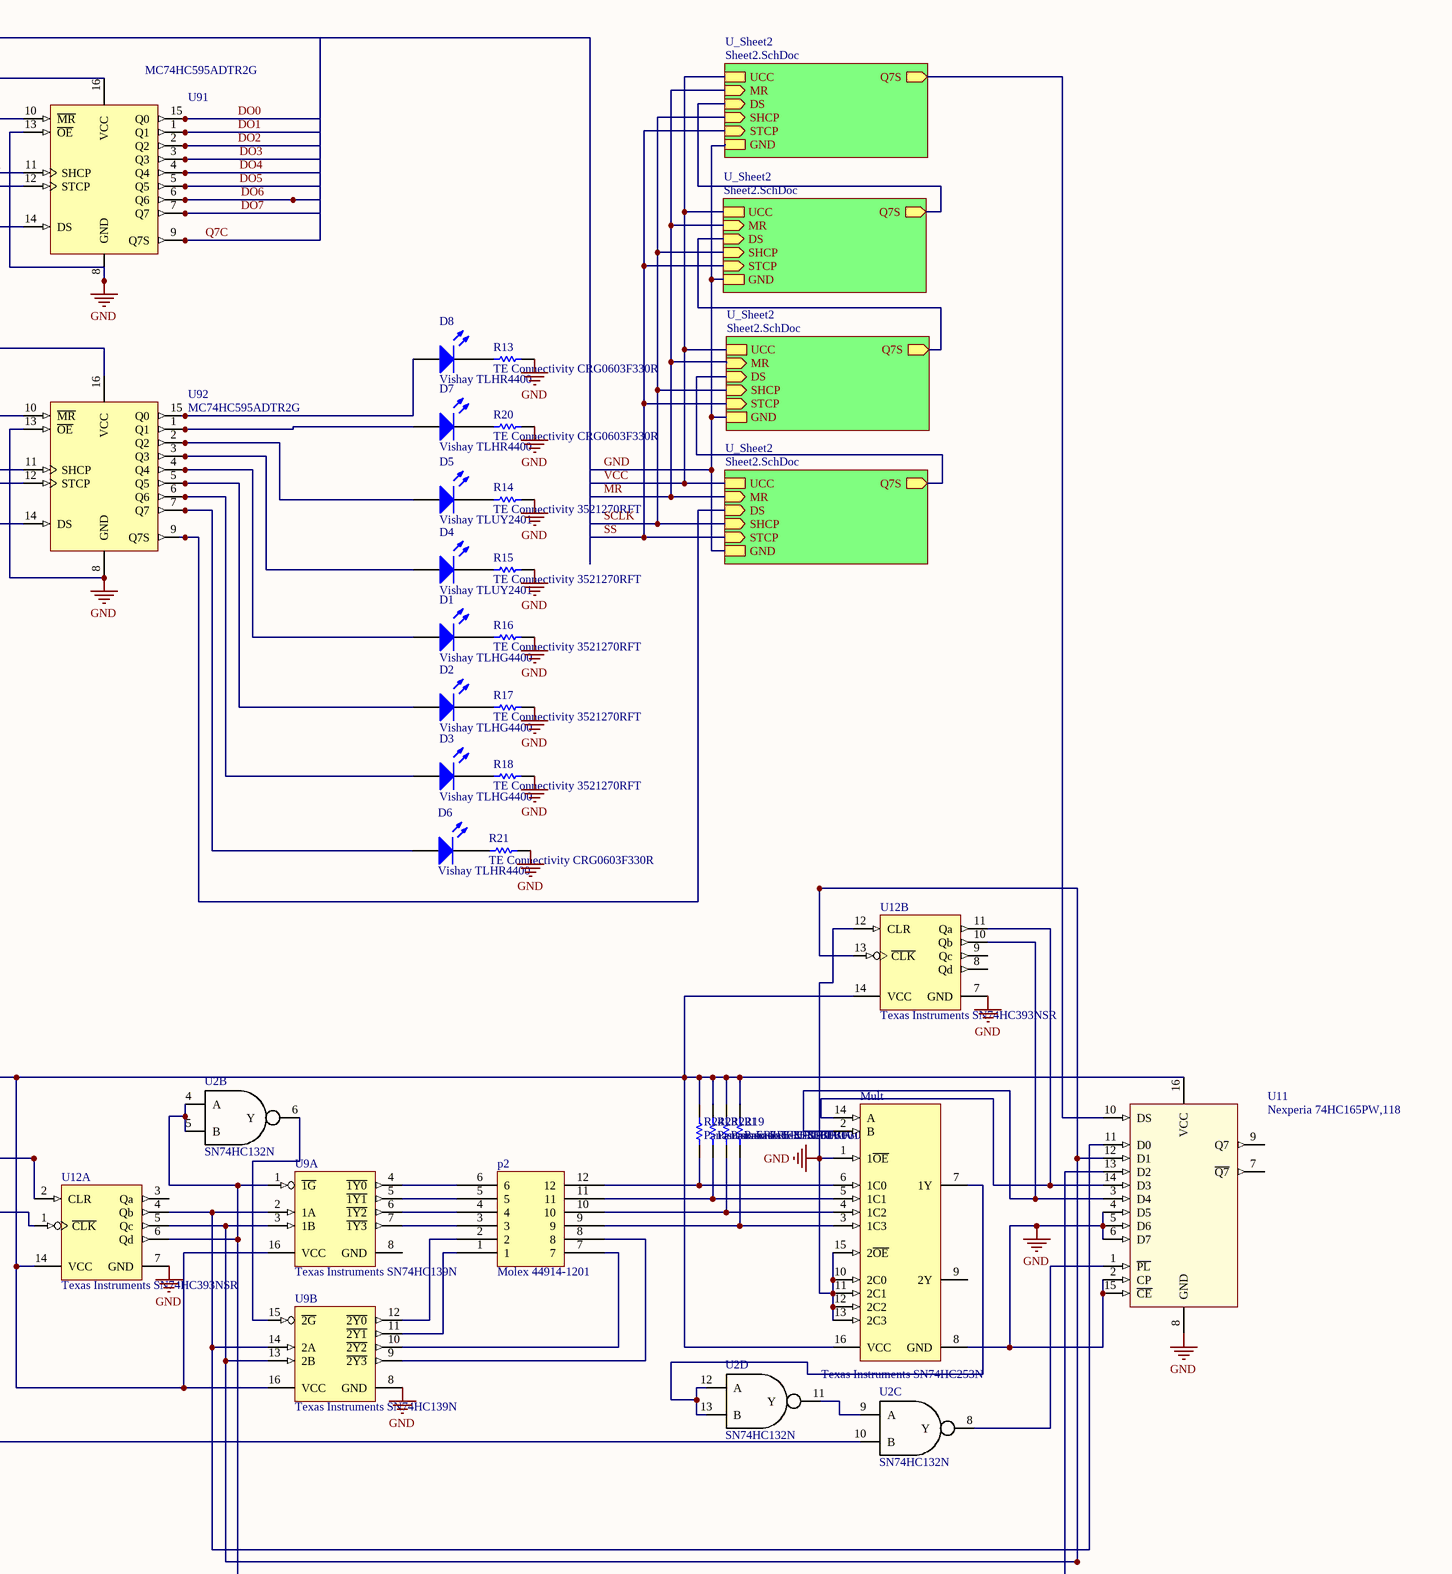
[diagram p3: Sheet1.SchDoc, right]

### Parts
C6  Murata GRM033R61A104KE15D  [201-cap]
C7  Murata GRM033R61A104KE15D  [201-cap]
C8  Murata GRM033R61A104KE15D  [201-cap]
C9  Murata GRM033R61A104KE15D  [201-cap]
C10  Murata GRM033R61A104KE15D  [201-cap]
C11  Murata GRM033R61A104KE15D  [201-cap]
C12  Murata GRM033R61A104KE15D  [201-cap]
C13  Murata GRM033R61A104KE15D  [201-cap]
C14  Murata GRM033R61A104KE15D  [201-cap]
C15  Murata GRM033R61A104KE15D  [201-cap]
C16  Murata GRM033R61A104KE15D  [201-cap]
C17  Murata GRM033R61A104KE15D  [201-cap]
C18  Murata GRM033R61A104KE15D  [201-cap]
C19  Murata GRM033R61A104KE15D  [201-cap]
C20  Murata GRM033R61A104KE15D  [201-cap]
C21  Murata GRM033R61A104KE15D  [201-cap]
C22  Murata GRM033R61A104KE15D  [201-cap]
C23  Panasonic 10SVP10M  [PCB-11675369-2]
C35  Murata GRM033R61A104KE15D  [201-cap]
D1  Vishay TLHG4400  [PCB-13611427-1]
D2  Vishay TLHG4400  [PCB-13611427-1]
D3  Vishay TLHG4400  [PCB-13611427-1]
D4  Vishay TLUY2401  [PCB-l34c6o5fqdn1w8o8huke-1]
D5  Vishay TLUY2401  [PCB-l34c6o5fqdn1w8o8huke-1]
D6  Vishay TLHR4400  [PCB-13611427-1]
D7  Vishay TLHR4400  [PCB-13611427-1]
D8  Vishay TLHR4400  [PCB-13611427-1]
Mult  Texas Instruments SN74HC253N  [PCB-ye28ecx4y6fys8yx3b68-1]
P1  TE Connectivity 1-215307-0  [TE Connectivity 1-215307-0-Footprint-1]
p2  Molex 44914-1201  [PCB-wm5mi6ljvffjb7arr4wv-1]
R5  TE Connectivity CRG0603F10K  [RESC1608X55X30NL15T15]
R6  TE Connectivity CRG0603F10K  [RESC1608X55X30NL15T15]
R8  TE Connectivity CRG0603F10K  [RESC1608X55X30NL15T15]
R9  TE Connectivity CRG0603F10K  [RESC1608X55X30NL15T15]
R10  TE Connectivity CRG0603F10K  [RESC1608X55X30NL15T15]
R11  TE Connectivity CRG0603F10K  [RESC1608X55X30NL15T15]
R12  TE Connectivity CRG0603F10K  [RESC1608X55X30NL15T15]
R13  TE Connectivity CRG0603F330R  [RESC1608X55X30NL15T15]
R14  TE Connectivity 3521270RFT  [PCB-8lzq24m2ds8udzy06dcv-1]
R15  TE Connectivity 3521270RFT  [PCB-8lzq24m2ds8udzy06dcv-1]
R16  TE Connectivity 3521270RFT  [PCB-8lzq24m2ds8udzy06dcv-1]
R17  TE Connectivity 3521270RFT  [PCB-8lzq24m2ds8udzy06dcv-1]
R18  TE Connectivity 3521270RFT  [PCB-8lzq24m2ds8udzy06dcv-1]
R19  Panasonic ERJ-3EKF3001V  [RESC1608X55X30LL15T15]
R20  TE Connectivity CRG0603F330R  [RESC1608X55X30NL15T15]
R21  TE Connectivity CRG0603F330R  [RESC1608X55X30NL15T15]
R111  TE Connectivity CRG0603F10K  [RESC1608X55X30NL15T15]
R221  Panasonic ERJ-3EKF3001V  [RESC1608X55X30LL15T15]
R222  TE Connectivity CRG0603F10K  [RESC1608X55X30NL15T15]
R231  Panasonic ERJ-3EKF3001V  [RESC1608X55X30LL15T15]
R241  Panasonic ERJ-3EKF3001V  [RESC1608X55X30LL15T15]
R333  TE Connectivity CRG0603F10K  [RESC1608X55X30NL15T15]
R444  TE Connectivity CRG0603F10K  [RESC1608X55X30NL15T15]
R777  TE Connectivity CRG0603F10K  [RESC1608X55X30NL15T15]
S1  TE Connectivity GDH04S04  [PCB-m0pir8bbp0qlyzv1so26-1]
S2  TE Connectivity GDH04S04  [PCB-m0pir8bbp0qlyzv1so26-1]
S3  TE Connectivity GDH04S04  [PCB-m0pir8bbp0qlyzv1so26-1]
U2  SN74HC132N  [DIP14]  (parts A,B,C,D,E of 5)
U3  NXP Semiconductors 74HC125D,653  [SO14]
U4  Nexperia 74HC165PW,118  [PCB-l7v5lpviuh96d6vuhrfj-1]
U5  Nexperia 74HC165PW,118  [PCB-l7v5lpviuh96d6vuhrfj-1]
U9  Texas Instruments SN74HC139N  [PCB-ctj26q9zb3sevqagct1v-1]  (parts A,B of 2)
U11  Nexperia 74HC165PW,118  [PCB-l7v5lpviuh96d6vuhrfj-1]
U12  Texas Instruments SN74HC393NSR  [SOIC-SL14_N]  (parts A,B of 2)
U91  MC74HC595ADTR2G  [MC74HC595ADTR2G-Footprint-1]
U92  MC74HC595ADTR2G  [MC74HC595ADTR2G-Footprint-1]
U111  Nexperia 74HC165PW,118  [PCB-l7v5lpviuh96d6vuhrfj-1]

### Sub-sheets
U_Sheet2 = Sheet2.SchDoc: UCC, MR (in), DS (in), SHCP (in), STCP (in), GND, Q7S (out)
U_Sheet2 = Sheet2.SchDoc: UCC, MR (in), DS (in), SHCP (in), STCP (in), GND, Q7S (out)
U_Sheet2 = Sheet2.SchDoc: UCC, MR (in), DS (in), SHCP (in), STCP (in), GND, Q7S (out)
U_Sheet2 = Sheet2.SchDoc: UCC, MR (in), DS (in), SHCP (in), STCP (in), GND, Q7S (out)

### Ports
GND, MISO (bidir), MOSI (in), SCLK (in), SS (in), VCC

### Nets
GND: C6.2 C7.1 C8.2 C9.1 C10.2 C11.1 C12.2 C13.1 C14.2 C15.1 C16.2 C17.1 C18.2 C19.1 C20.2 C22.2 C23.2 C35.2 Mult.1(1~{OE}) Mult.8(GND) Mult.10(2C0) Mult.11(2C1) Mult.12(2C2) Mult.13(2C3) Mult.15(2~{OE}) R13.2 R14.2 R15.2 R16.2 R17.2 R18.2 R20.2 R21.2 S1.1 S1.2 S1.3 S1.4 S2.1 S2.2 S2.3 S2.4 S3.1 S3.2 S3.3 S3.4 U2.3(Y) U2.7(GND) U3.7(GND) U3.11(4Y) U4.1(~{PL}) U4.8(GND) U4.11(D0) U4.12(D1) U4.13(D2) U4.14(D3) U5.1(~{PL}) U5.8(GND) U9.8(GND) U11.2(CP) U11.4(D5) U11.5(D6) U11.6(D7) U11.8(GND) U11.15(~{CE}) U12.2(CLR) U12.7(GND) U12.12(CLR) U91.8(GND) U91.13(~{OE}) U92.8(GND) U92.13(~{OE}) U111.1(~{PL}) U111.8(GND) U111.10(DS) U111.11(D0) U111.12(D1) U111.13(D2) U111.14(D3) ; port GND, sheet U_Sheet2/GND, sheet U_Sheet2/GND, sheet U_Sheet2/GND, sheet U_Sheet2/GND
DO0: P1.1 U91.15(Q0)
DO1: P1.3 U91.1(Q1)
DO2: P1.5 U91.2(Q2)
DO3: P1.7 U91.3(Q3)
DO4: P1.9 U91.4(Q4)
DO5: P1.11 U91.5(Q5)
DO6: P1.13 U91.6(Q6)
DO7: P1.15 U91.7(Q7)
KCLK: P1.2 U12.1(~{CLK})
MISO: U3.8(3Y) ; port MISO
MOSI: U3.5(2A) ; port MOSI
MR: P1.17 U91.10(~{MR}) U92.10(~{MR}) ; sheet U_Sheet2/MR, sheet U_Sheet2/MR, sheet U_Sheet2/MR, sheet U_Sheet2/MR
Q7C: U91.9(Q7S) U92.14(DS)
SCLK: U3.3(1Y) U4.2(CP) U5.2(CP) U91.11(SHCP) U92.11(SHCP) U111.2(CP) ; sheet U_Sheet2/SHCP, sheet U_Sheet2/SHCP, sheet U_Sheet2/SHCP, sheet U_Sheet2/SHCP
SCLK1: U3.2(1A) ; port SCLK
SS: U2.2(B) U3.1(1~{OE}) U3.4(2~{OE}) U3.10(3~{OE}) U4.15(~{CE}) U5.15(~{CE}) U111.15(~{CE}) ; port SS
SS: U2.10(B) U91.12(STCP) U92.12(STCP) ; sheet U_Sheet2/STCP, sheet U_Sheet2/STCP, sheet U_Sheet2/STCP, sheet U_Sheet2/STCP  [a separate net that carries the same name]
VCC: C6.1 C7.2 C8.1 C9.2 C10.1 C11.2 C12.1 C13.2 C14.1 C15.2 C16.1 C17.2 C18.1 C19.2 C20.1 C21.2 C22.1 C23.1 C35.1 Mult.16(VCC) R5.1 R6.1 R8.1 R9.1 R10.1 R11.1 R12.1 R19.1 R111.1 R221.1 R222.1 R231.1 R241.1 R333.1 R444.1 R777.1 U2.14(VCC) U3.14(VCC) U4.16(VCC) U5.16(VCC) U9.16(VCC) U11.16(VCC) U12.14(VCC) U91.16(VCC) U92.16(VCC) U111.16(VCC) ; port VCC, sheet U_Sheet2/UCC, sheet U_Sheet2/UCC, sheet U_Sheet2/UCC, sheet U_Sheet2/UCC
WR: P1.19 U2.1(A)
NetD1_1: D1.1(A) U92.4(Q4)
NetD1_2: D1.2(K) R16.1
NetD2_1: D2.1(A) U92.5(Q5)
NetD2_2: D2.2(K) R17.1
NetD3_1: D3.1(A) U92.6(Q6)
NetD3_2: D3.2(K) R18.1
NetD4_1: D4.1(A) U92.3(Q3)
NetD4_2: D4.2(K) R15.1
NetD5_1: D5.1(A) U92.2(Q2)
NetD5_2: D5.2(K) R14.1
NetD6_1: D6.1(A) U92.7(Q7)
NetD7_1: D7.1(A) U92.1(Q1)
NetD7_2: D7.2(K) R20.1
NetD8_1: D8.1(A) U92.15(Q0)
NetD8_2: D8.2(K) R13.1
NetMult_2: Mult.2(B) U11.3(D4) U12.10(Qb)
NetMult_3: Mult.3(1C3) p2.9 R19.2
NetMult_4: Mult.4(1C2) p2.10 R221.2
NetMult_5: Mult.5(1C1) p2.11 R231.2
NetMult_6: Mult.6(1C0) p2.12 R241.2
NetMult_7: Mult.7(1Y) U2.12(A) U2.13(B)
NetMult_14: Mult.14(A) U11.14(D3) U12.11(Qa)
NetP1_14: P1.14 U111.3(D4)
NetP1_16: P1.16 U111.4(D5)
NetP1_18: P1.18 U111.5(D6)
NetP1_20: P1.20 U111.6(D7)
Netp2_1: p2.1 U9.11(~{2Y1})
Netp2_2: p2.2 U9.12(~{2Y0})
Netp2_3: p2.3 U9.7(~{1Y3})
Netp2_4: p2.4 U9.6(~{1Y2})
Netp2_5: p2.5 U9.5(~{1Y1})
Netp2_6: p2.6 U9.4(~{1Y0})
Netp2_7: p2.7 U9.10(~{2Y2})
Netp2_8: p2.8 U9.9(~{2Y3})
NetR5_2: R5.2 S2.8 U5.3(D4)
NetR6_2: R6.2 S2.7 U5.4(D5)
NetR8_2: R8.2 S2.5 U5.6(D7)
NetR9_2: R9.2 S3.8 U4.3(D4)
NetR10_2: R10.2 S3.7 U4.4(D5)
NetR11_2: R11.2 S3.6 U4.5(D6)
NetR12_2: R12.2 S3.5 U4.6(D7)
NetR111_2: R111.2 S1.8 U5.11(D0)
NetR222_2: R222.2 S1.7 U5.12(D1)
NetR333_2: R333.2 S1.6 U5.13(D2)
NetR444_2: R444.2 S1.5 U5.14(D3)
NetR777_2: R777.2 S2.6 U5.5(D6)
NetU2_4: U2.4(A) U2.5(B) U9.1(~{1G}) U11.13(D2) U12.6(Qd)
NetU2_6: U2.6(Y) U9.15(~{2G})
NetU2_8: U2.8(Y) U11.1(~{PL})
NetU2_9: U2.9(A) U2.11(Y)
NetU3_6: U3.6(2Y) U91.14(DS)
NetU4_10: U4.10(DS) U5.9(Q7)
NetU5_10: U5.10(DS) U111.9(Q7)
NetU6_$ChannelName#1_9: sheet U_Sheet2/Q7S, sheet U_Sheet2/DS
NetU6_$ChannelName#1_14: U92.9(Q7S) ; sheet U_Sheet2/DS
NetU6_$ChannelName#2_9: sheet U_Sheet2/Q7S, sheet U_Sheet2/DS
NetU6_$ChannelName#3_9: sheet U_Sheet2/Q7S, sheet U_Sheet2/DS
NetU6_$ChannelName#4_9: U11.10(DS) ; sheet U_Sheet2/Q7S
NetU9_2: U9.2(1A) U9.14(2A) U11.11(D0) U12.4(Qb)
NetU9_3: U9.3(1B) U9.13(2B) U11.12(D1) U12.5(Qc) U12.13(~{CLK})

Not connected (* = marked no-connect by the designer): C21 1; D6 2(K); Mult 9(2Y); P1 4 6 8 10 12; R21 1; U3 9(3A) 12(4A) 13(4~{OE}); U4 7(~{Q7}) 9(Q7); U5 7(~{Q7}); U11 7(~{Q7}) 9(Q7); U12 3(Qa) 8(Qd) 9(Qc); U111 7(~{Q7})

### Library data of the parts
C6-C22 C35 = CMP-118834-6: as C1 on sheet analog; REACH SVHC Compliance: No SVHC; Capacitance Tolerance: ±10%; Voltage Rating (DC): 10 V; Lifecycle Status: Active; Octopart Url: https://octopart.com/grm033r61a104ke15d-murata-9105476; Footprint: PCB-ocfpa7uzfom1ouwa1npm-1; Size-Length: 0.0006 m; Size-Thickness: 0.0003 m; Manufacturer Part Number: GRM033R61A104KE15D; Dielectric Characteristic: X5R; OctopartID: 128bdb0bc7a9cd4c; RoHS: Compliant; Size-Width: 0.0003 m
C23 = CMP-11675369-3: CAP ALUM 10UF 10V 20% SMD; Capacitance: 1e-05 F; Equivalent Series Resistance (ESR): 0.22 Ω; Lead-Free Status: Lead Free; Voltage Rating (DC): 10.0 V; Capacitance Tolerance: ±20%; Lifecycle Status: Not Listed by Manufacturer; Octopart Url: https://octopart.com/10svp10m-panasonic-29498231; OctopartID: 0b69c3a13578d4ae; Packaging: Cut Tape (CT); REACH SVHC Compliance: No SVHC; RoHS: Compliant; Size-Diameter: 0.004 m; Size-Height: 0.0054 m; Manufacturer Part Number: 10SVP10M
D1-D3 = CMP-96ad5dfef654496a-28: LED; Green; 2.5mcd; 3mmDia.; T-1; 20mA; 2.4V; 569nm; +/-30deg; GaP on GaP; 15V; 100mW
D4 D5 = CMP-e0242b7785343fe3-2: LED; Yellow; 8mcd; 2.4mm; T-3/4; 30mA; 2.4V; +/-20deg; 585nm; GaAsP on GaP; Lens Type: Diffused; Luminous Intensity: 8.00 mcd; Wavelength: 594 nm; Voltage Rating (DC): 2.40 V; Lead Length: 25.4 mm; Power Dissipation: 100 mW; Lead-Free Status: Lead Free; Viewing Angle: 20 °; Operating Temperature: -40.0 °C (min); RoHS: Compliant; Manufacturer Part Number: TLUY2401; OctopartID: e0242b7785343fe3; Mounting Style: Through Hole, PCB; Number of Pins: 2; Peak Wavelength: 585 nm; Size-Diameter: 2.40 mm; Forward Voltage: 2.40 V; Octopart URL: https://octopart.com/tluy2401-vishay-39403638; Color: Yellow
D6-D8 = CMP-87d34d9479b75814-3: LED; Red; 3mcd; 3mmDia.; T-1; 30mA; 2V; 635nm; +/-30deg; GaAsP on GaP; 15V; 100mW; Forward Voltage: 2.00 V; Viewing Angle: 30 °; Lead-Free Status: Lead Free; Luminous Intensity: 3.00 mcd; Wavelength: 625 nm; Packaging: Bulk; Number of Pins: 2; Octopart Url: https://octopart.com/tlhr4400-vishay-55433986; Mounting Style: Through Hole, PCB; Color: Red; Size-Diameter: 3.00 mm; Manufacturer Part Number: TLHR4400; Power Dissipation: 100 mW; Peak Wavelength: 635 nm; Operating Temperature: -40.0 °C (min); RoHS: Compliant; OctopartID: 87d34d9479b75814
Mult = CMP-94ae5da5050f4b69-1: Dual 4-Line To 1-Line Data Selectors/Multiplexers With 3-State Outputs 16-PDIP -40 to 85; Bandwidth: 28.0 MHz; Supply Voltage (DC): 2.00 V to 6.00 V; Polarity: Non-Inverting; Voltage Nodes: 2.00 V, 5.00 V, 6.00 V; Output Current Drive: -1.00 mA; Quiescent Current: 8.00 µA (max); Contacts Type: 4PST; Number of Bits: 4; Number of Circuits: 2; Lead-Free Status: Lead Free; Operating Temperature: -40.0 °C to 85.0 °C; Packaging: Tube; Case/Package: PDIP, SOIC; Octopart URL: https://octopart.com/sn74hc253n-texas+instruments-111815; REACH SVHC Compliance: No SVHC; Number of Pins: 16; OctopartID: 94ae5da5050f4b69; Manufacturer Part Number: SN74HC253N; RoHS: Compliant; Mounting Style: Through Hole; Lifecycle Status: Active
P1 = CMP-5b4e90303ce88489-3: AMPMODU Series 10 Position Dual Row 2.54 mm Through Hole Receptacle; Number of Contacts: 20; Number of Positions: 10; Gender: Female; ELV Compliant: Compliant; Housing Color: Green; Flammability Rating: UL 94 V-0; Packaging: Bulk; REACH SVHC Compliance: No SVHC; Color: Green; Operating Temperature: -55.0 °C to 105 °C; Housing Material: Polyester; Octopart Url: https://octopart.com/1-215307-0-te+connectivity-41173696; RoHS: Compliant; Mounting Style: Through Hole, Vertical, PCB; OctopartID: 5b4e90303ce88489; Lifecycle Status: Active; Contact Plating: Tin, Gold; Orientation: Vertical; Contact Material: Phosphor Bronze; Manufacturer Part Number: 1-215307-0
p2 = CMP-e0aa29c762ee3f6d-3: Conn Power HDR 12 POS 3mm Press Fit ST Thru-Hole 12 Terminal 1 Port Micro-Fit 3.0 CPI™ Tray
R5 R6 R8-R12 R111 R222 R333 R444 R777 = CMP-584891b72cc4878f-5: Thick Film Resistors - SMD 10K Ohm 1% 1/10W Res Thick Film 0603; Resistance: 10.0 kΩ; ELV Compliant: Compliant; Power Rating: 100 mW; Lead-Free Status: Lead Free; Lifecycle Status: Active; Octopart URL: https://octopart.com/crg0603f10k-te+connectivity-16077290; Manufacturer: TE Connectivity; Series: CRG; Manufacturer Part Number: CRG0603F10K; Footprint: PCB-ardgfr1918pjvxvewvwp-1; OctopartID: 584891b72cc4878f; Case/Package: 0603; Mounting Style: Surface Mount; RoHS: Compliant; Packaging: Tape & Reel (TR)
R13 R20 R21 = CMP-139fda6064c8cc58-2: Res Thick Film 0603 330 Ohm 1% 0.1W(1/10W) ±100ppm/C Pad SMD T/R; ELV Compliant: Compliant; Resistance: 330 Ω; Power Rating: 100 mW; Manufacturer Part Number: CRG0603F330R; Footprint: PCB-0002-00066-3; RoHS: Compliant; Mounting Style: Surface Mount; Lifecycle Status: Active; Case/Package: 0603; OctopartID: 139fda6064c8cc58; Packaging: Tape & Reel (TR); Octopart URL: https://octopart.com/crg0603f330r-te+connectivity-16077361
R14-R18 = CMP-1f58d739f3e6c09f-1: 3521 Series 2512 270 Ohm ±1 % 2 W ±100 ppm/°C Surface Mount Thick Film Resistor; Resistance Tolerance: ±1%; Voltage Rating (DC): 250 V; Resistance: 270 Ω; ELV Compliant: Compliant; Lead-Free Status: Lead Free; Temperature Coefficient: -100 ppm/°C to 100 ppm/°C; Power Rating: 2.00 W; REACH SVHC Compliance: No SVHC; RoHS: Compliant; Manufacturer Part Number: 3521270RFT; Lifecycle Status: Not Listed by Manufacturer; Octopart Url: https://octopart.com/3521270rft-te+connectivity-23841240; OctopartID: 1f58d739f3e6c09f; Mounting Style: Surface Mount; Packaging: Tape & Reel (TR)
R19 R221 R231 R241 = CMP-3655905-2: Thick Film Resistors - SMD 0603 3Kohms 1% Tol; Lead-Free Status: Lead Free; Power Rating: 0.1 W; Resistance: 3000.0 Ω; Voltage Rating (DC): 75.0 V; Case/Package: 0603; Lifecycle Status: Not Listed by Manufacturer; Mounting Style: Surface Mount; Octopart Url: https://octopart.com/erj-3ekf3001v-panasonic-42329147; OctopartID: 963d5db2576049fa; REACH SVHC Compliance: No SVHC; Resistance Tolerance: ±1%; RoHS: Compliant; Manufacturer Part Number: ERJ-3EKF3001V
S1-S3 = CMP-6f23a477cc17b0e4-5: Switch DIP OFF ON SPST 4 Recessed Rocker 0.025A 24VDC Gull Wing 1.27mm SMD; Lead-Free Status: Lead Free; Contact Resistance: 100 mΩ; Number of Positions: 4; Manufacturer Part Number: GDH04S04; Contact Plating: Gold; Pin Pitch: 1.27 mm; RoHS: Compliant; Contacts Type: SPST; Size-Length: 6.20 mm; Size-Width: 6.00 mm; Orientation: Vertical; Octopart URL: http://octopart.com/gdh04s04-te+connectivity-39749202; Size-Height: 2.30 mm; Mounting Style: Surface Mount; Lifecycle Status: Not Listed by Manufacturer; Actuator Type: Rocker; REACH SVHC Compliance: No SVHC; Flammability Rating: UL 94 V-0; Insulation Resistance: 100 MΩ; OctopartID: 6f23a477cc17b0e4; Footprint: PCB-hg5w1tp1hwp4ddcu42yg-1
U2 = CMP-ee722778a28031b5-2: Quadruple Positive-NAND Gates With Schmitt-Trigger Inputs 14-PDIP -40 to 85; Number of Circuits: 4; Supply Voltage (DC): 2.00 V to 6.00 V; Voltage Nodes: 6.00 V, 5.00 V, 2.00 V; Lead-Free Status: Lead Free; Propagation Delay Max (tpd): 27.0 ns; Output Current: 5.20 mA; Output Current Drive: -1.00 mA; Octopart URL: http://octopart.com/sn74hc132n-texas+instruments-27028; Number of Pins: 14; RoHS: Compliant; Number of Gates: 4; Manufacturer Part Number: SN74HC132N; OctopartID: ee722778a28031b5; Number of Bits: 4; Case/Package: PDIP; REACH SVHC Compliance: No SVHC; Packaging: Tube; Lifecycle Status: Active; Footprint: PCB-547ae6yrb5qq8sq3b9tw-1; Mounting Style: Through Hole
U3 = CMP-e63b2fae16a839fc-1: as U14 on sheet analog; REACH SVHC Compliance: No SVHC; Lifecycle Status: Active; Packaging: Tape & Reel (TR); Manufacturer Part Number: 74HC125D,653; OctopartID: e63b2fae16a839fc; Octopart URL: http://octopart.com/74hc125d%2C653-nxp+semiconductors-10474997; Number of Pins: 14; RoHS: Compliant
U4 U5 U11 U111 = CMP-d6a61b1d9d060961-1: 74HC Series 6 V 8-Bit Parallel-In/Serial Out Shift Register - TSSOP-16; RoHS: Compliant; OctopartID: d6a61b1d9d060961; Manufacturer Part Number: 74HC165PW,118; Octopart Url: https://octopart.com/74hc165pw%2C118-nexperia-78737094; Lifecycle Status: Active; Number of Pins: 14
U9 = CMP-00b6c9bc66ecdf71-2: Dual 2-Line To 4-Line Decoders/Demultiplexers 16-PDIP -40 to 85; Lead-Free Status: Lead Free; Number of Outputs: 4; Number of Circuits: 2; Output Current Drive: -1.00 mA; Contacts Type: DP4T; Supply Voltage (DC): 2.00 V to 6.00 V; Voltage Nodes: 6.00 V, 5.00 V, 2.00 V; Packaging: Tube; Number of Pins: 16; Number of Bits: 4; Case/Package: SOIC, PDIP; Lifecycle Status: Active; Manufacturer Part Number: SN74HC139N; Octopart URL: http://octopart.com/sn74hc139n-texas+instruments-17212; Mounting Style: Through Hole; RoHS: Compliant; OctopartID: 00b6c9bc66ecdf71; REACH SVHC Compliance: No SVHC
U12 = CMP-3cf3f5f3f6c2e334-2: Counter/Divider Dual 4-Bit Binary UP 14-Pin SOP T/R   SMD; Voltage Nodes: 2.00 V, 5.00 V, 6.00 V; Number of Bits: 4; Output Current Drive: -1.00 mA; Clock Speed: 60.0 MHz; Supply Voltage (DC): 2.00 V to 6.00 V; Lead-Free Status: Lead Free; Packaging: Reel; Lifecycle Status: Active; Operating Temperature: -40.0 °C to 85.0 °C; Footprint: PCC-0016-00091-1; Number of Pins: 14; Manufacturer Part Number: SN74HC393NSR; OctopartID: 3cf3f5f3f6c2e334; Mounting Style: Surface Mount; RoHS: Compliant; Octopart URL: https://octopart.com/sn74hc393nsr-texas+instruments-716631; Case/Package: SOP
U91 U92 = CMP-ba6473693a2065a3-3: Shift Shift Register 1 Element 8 Bit 16-TSSOP; OctopartID: ba6473693a2065a3

## Sheet Sheet2.SchDoc
size A4; SheetNumber: 2; SheetTotal: 3
Used 4 times, as channels U_Sheet1/U_Sheet2, U_Sheet1/U_Sheet2, U_Sheet1/U_Sheet2, U_Sheet1/U_Sheet2. Parts and nets are listed once, with the designators drawn on the sheet.
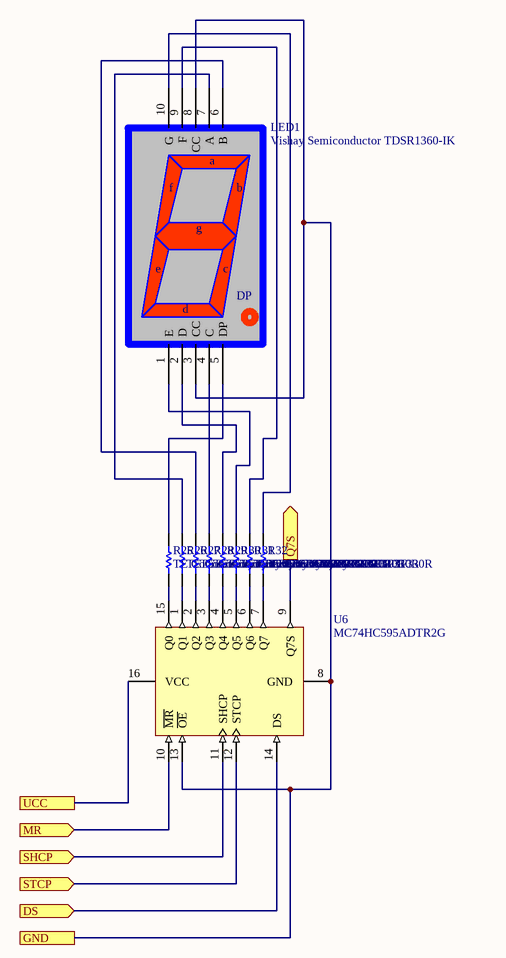
[diagram p4: Sheet2.SchDoc]

### Parts
LED1  Vishay Semiconductor TDSR1360-IK  [PCB-wjfw9shywxa82n8451hf-1]
R25  TE Connectivity CRG0603F330R  [RESC1608X55X30NL15T15]
R26  TE Connectivity CRG0603F330R  [RESC1608X55X30NL15T15]
R27  TE Connectivity CRG0603F330R  [RESC1608X55X30NL15T15]
R28  TE Connectivity CRG0603F330R  [RESC1608X55X30NL15T15]
R29  TE Connectivity CRG0603F330R  [RESC1608X55X30NL15T15]
R30  TE Connectivity CRG0603F330R  [RESC1608X55X30NL15T15]
R31  TE Connectivity CRG0603F330R  [RESC1608X55X30NL15T15]
R32  TE Connectivity CRG0603F330R  [RESC1608X55X30NL15T15]
U6  MC74HC595ADTR2G  [MC74HC595ADTR2G-Footprint-1]

### Ports
DS (in), GND, MR (in), Q7S (out), SHCP (in), STCP (in), UCC

### Nets
DS: U6.14(DS) ; port DS
GND: LED1.3(CC) LED1.8(CC) U6.8(GND) U6.13(~{OE}) ; port GND
MR: U6.10(~{MR}) ; port MR
Q7S: U6.9(Q7S) ; port Q7S
SHCP: U6.11(SHCP) ; port SHCP
STCP: U6.12(STCP) ; port STCP
UCC: U6.16(VCC) ; port UCC
NetLED1_1: LED1.1(E) R30.2
NetLED1_2: LED1.2(D) R29.2
NetLED1_4: LED1.4(C) R28.2
NetLED1_5: LED1.5(DP) R25.2
NetLED1_6: LED1.6(B) R27.2
NetLED1_7: LED1.7(A) R26.2
NetLED1_9: LED1.9(F) R31.2
NetLED1_10: LED1.10(G) R32.2
NetR25_1: R25.1 U6.15(Q0)
NetR26_1: R26.1 U6.1(Q1)
NetR27_1: R27.1 U6.2(Q2)
NetR28_1: R28.1 U6.3(Q3)
NetR29_1: R29.1 U6.4(Q4)
NetR30_1: R30.1 U6.5(Q5)
NetR31_1: R31.1 U6.6(Q6)
NetR32_1: R32.1 U6.7(Q7)

### Channels
U_Sheet1/U_Sheet2: designators end in _$ChannelName#1; ports DS=NetU6_$ChannelName#1_14 GND=GND MR=MR Q7S=NetU6_$ChannelName#1_9 SHCP=SCLK STCP=SS UCC=VCC
U_Sheet1/U_Sheet2: designators end in _$ChannelName#2; ports DS=NetU6_$ChannelName#1_9 GND=GND MR=MR Q7S=NetU6_$ChannelName#2_9 SHCP=SCLK STCP=SS UCC=VCC
U_Sheet1/U_Sheet2: designators end in _$ChannelName#3; ports DS=NetU6_$ChannelName#2_9 GND=GND MR=MR Q7S=NetU6_$ChannelName#3_9 SHCP=SCLK STCP=SS UCC=VCC
U_Sheet1/U_Sheet2: designators end in _$ChannelName#4; ports DS=NetU6_$ChannelName#3_9 GND=GND MR=MR Q7S=NetU6_$ChannelName#4_9 SHCP=SCLK STCP=SS UCC=VCC

### Notes on the sheet
- (in symbol CMP-f4ae3c33d6e22b69-5) a; f; b; g; e; c; d

### Library data of the parts
LED1 = CMP-f4ae3c33d6e22b69-5: Displays Dot Matrix Module 1DIGIT 8LED Red 10-Pin DIP Tube; Luminous Intensity: 3.60 mcd; Character Size-Height: 13.0 mm; Forward Voltage: 1.80 V; Octopart URL: http://octopart.com/tdsr1360-ik-vishay+semiconductor-26674986; Color: Red; OctopartID: f4ae3c33d6e22b69; Manufacturer Part Number: TDSR1360-IK; RoHS: Compliant; Case/Package: DIP
R25-R32 = CMP-139fda6064c8cc58-2: as R13 on sheet Sheet1; Manufacturer Part Number: CRG0603F330R; Footprint: PCB-0002-00066-3; RoHS: Compliant; Mounting Style: Surface Mount; Lifecycle Status: Active; Case/Package: 0603; OctopartID: 139fda6064c8cc58; Packaging: Tape & Reel (TR); Octopart URL: https://octopart.com/crg0603f330r-te+connectivity-16077361
U6 = CMP-ba6473693a2065a3-3: as U91 on sheet Sheet1; OctopartID: ba6473693a2065a3

## Nets that join several sheets
GND: KR1 (P4.7), analog (14 pins), Sheet1 (78 pins), U_Sheet1/U_Sheet2 (LED1_$ChannelName#1.3 LED1_$ChannelName#1.8 U6_$ChannelName#1.8 U6_$ChannelName#1.13), U_Sheet1/U_Sheet2 (LED1_$ChannelName#2.3 LED1_$ChannelName#2.8 U6_$ChannelName#2.8 U6_$ChannelName#2.13), U_Sheet1/U_Sheet2 (LED1_$ChannelName#3.3 LED1_$ChannelName#3.8 U6_$ChannelName#3.8 U6_$ChannelName#3.13), U_Sheet1/U_Sheet2 (LED1_$ChannelName#4.3 LED1_$ChannelName#4.8 U6_$ChannelName#4.8 U6_$ChannelName#4.13)
MISO: KR1 (P4.3), analog (U14.3), Sheet1 (U3.8)
MOSI: KR1 (P4.2), analog (R2.1), Sheet1 (U3.5)
MR: Sheet1 (P1.17 U91.10 U92.10), U_Sheet1/U_Sheet2 (U6_$ChannelName#1.10), U_Sheet1/U_Sheet2 (U6_$ChannelName#2.10), U_Sheet1/U_Sheet2 (U6_$ChannelName#3.10), U_Sheet1/U_Sheet2 (U6_$ChannelName#4.10)
NetU6_$ChannelName#1_9: U_Sheet1/U_Sheet2 (U6_$ChannelName#1.9), U_Sheet1/U_Sheet2 (U6_$ChannelName#2.14)
NetU6_$ChannelName#1_14: Sheet1 (U92.9), U_Sheet1/U_Sheet2 (U6_$ChannelName#1.14)
NetU6_$ChannelName#2_9: U_Sheet1/U_Sheet2 (U6_$ChannelName#2.9), U_Sheet1/U_Sheet2 (U6_$ChannelName#3.14)
NetU6_$ChannelName#3_9: U_Sheet1/U_Sheet2 (U6_$ChannelName#3.9), U_Sheet1/U_Sheet2 (U6_$ChannelName#4.14)
NetU6_$ChannelName#4_9: Sheet1 (U11.10), U_Sheet1/U_Sheet2 (U6_$ChannelName#4.9)
SCLK: Sheet1 (6 pins), U_Sheet1/U_Sheet2 (U6_$ChannelName#1.11), U_Sheet1/U_Sheet2 (U6_$ChannelName#2.11), U_Sheet1/U_Sheet2 (U6_$ChannelName#3.11), U_Sheet1/U_Sheet2 (U6_$ChannelName#4.11)
SCLK1: KR1 (P4.10), analog (R1.1), Sheet1 (U3.2)
SS: KR1 (P4.4), Sheet1 (7 pins)
SS: Sheet1 (U2.10 U91.12 U92.12), U_Sheet1/U_Sheet2 (U6_$ChannelName#1.12), U_Sheet1/U_Sheet2 (U6_$ChannelName#2.12), U_Sheet1/U_Sheet2 (U6_$ChannelName#3.12), U_Sheet1/U_Sheet2 (U6_$ChannelName#4.12)
SS1: KR1 (P4.5), analog (R3.1 U21.1)
SS2: KR1 (P4.6), analog (R4.1 U21.2)
VCC: KR1 (P4.9), analog (U13.1 U14.14 U21.14), Sheet1 (46 pins), U_Sheet1/U_Sheet2 (U6_$ChannelName#1.16), U_Sheet1/U_Sheet2 (U6_$ChannelName#2.16), U_Sheet1/U_Sheet2 (U6_$ChannelName#3.16), U_Sheet1/U_Sheet2 (U6_$ChannelName#4.16)